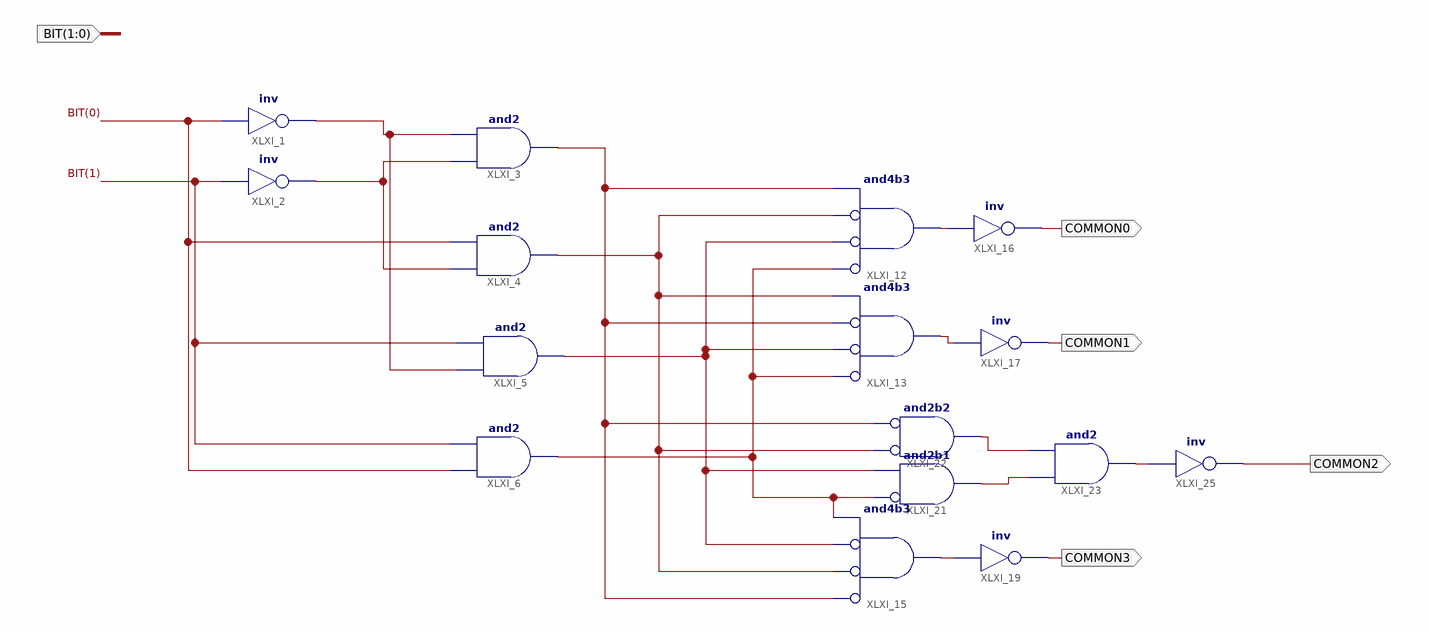
[diagram p0: schematic sheet 1]
// Xilinx ISE schematic Decoder2to4New.sch (spartan6) as structural Verilog: 16 symbols, 5 ports
module Decoder2to4New (
  input  [1:0] BIT,
  output COMMON0,
  output COMMON1,
  output COMMON3,
  output COMMON2
);

  wire com3, XLXN_1, XLXN_2, XLXN_14, XLXN_15, XLXN_16, XLXN_28, XLXN_29, XLXN_31, XLXN_37, XLXN_40, XLXN_52;

  not XLXI_1 (XLXN_1, BIT[0]);
  not XLXI_2 (XLXN_2, BIT[1]);
  and XLXI_3 (XLXN_14, XLXN_2, XLXN_1);
  and XLXI_4 (XLXN_15, XLXN_2, BIT[0]);
  and XLXI_5 (XLXN_16, XLXN_1, BIT[1]);
  and XLXI_6 (com3, BIT[0], BIT[1]);
  and XLXI_12 (XLXN_28, ~com3, ~XLXN_16, ~XLXN_15, XLXN_14);  // and4b3
  and XLXI_13 (XLXN_29, ~com3, ~XLXN_16, ~XLXN_14, XLXN_15);  // and4b3
  and XLXI_15 (XLXN_31, ~XLXN_14, ~XLXN_15, ~XLXN_16, com3);  // and4b3
  not XLXI_16 (COMMON0, XLXN_28);
  not XLXI_17 (COMMON1, XLXN_29);
  not XLXI_19 (COMMON3, XLXN_31);
  and XLXI_21 (XLXN_40, ~com3, XLXN_16);  // and2b1
  and XLXI_22 (XLXN_37, ~XLXN_15, ~XLXN_14);  // and2b2
  and XLXI_23 (XLXN_52, XLXN_40, XLXN_37);
  not XLXI_25 (COMMON2, XLXN_52);
endmodule
